# Altium schematic sheet Sensors.SchDoc
size Letter; SheetNumber: 11
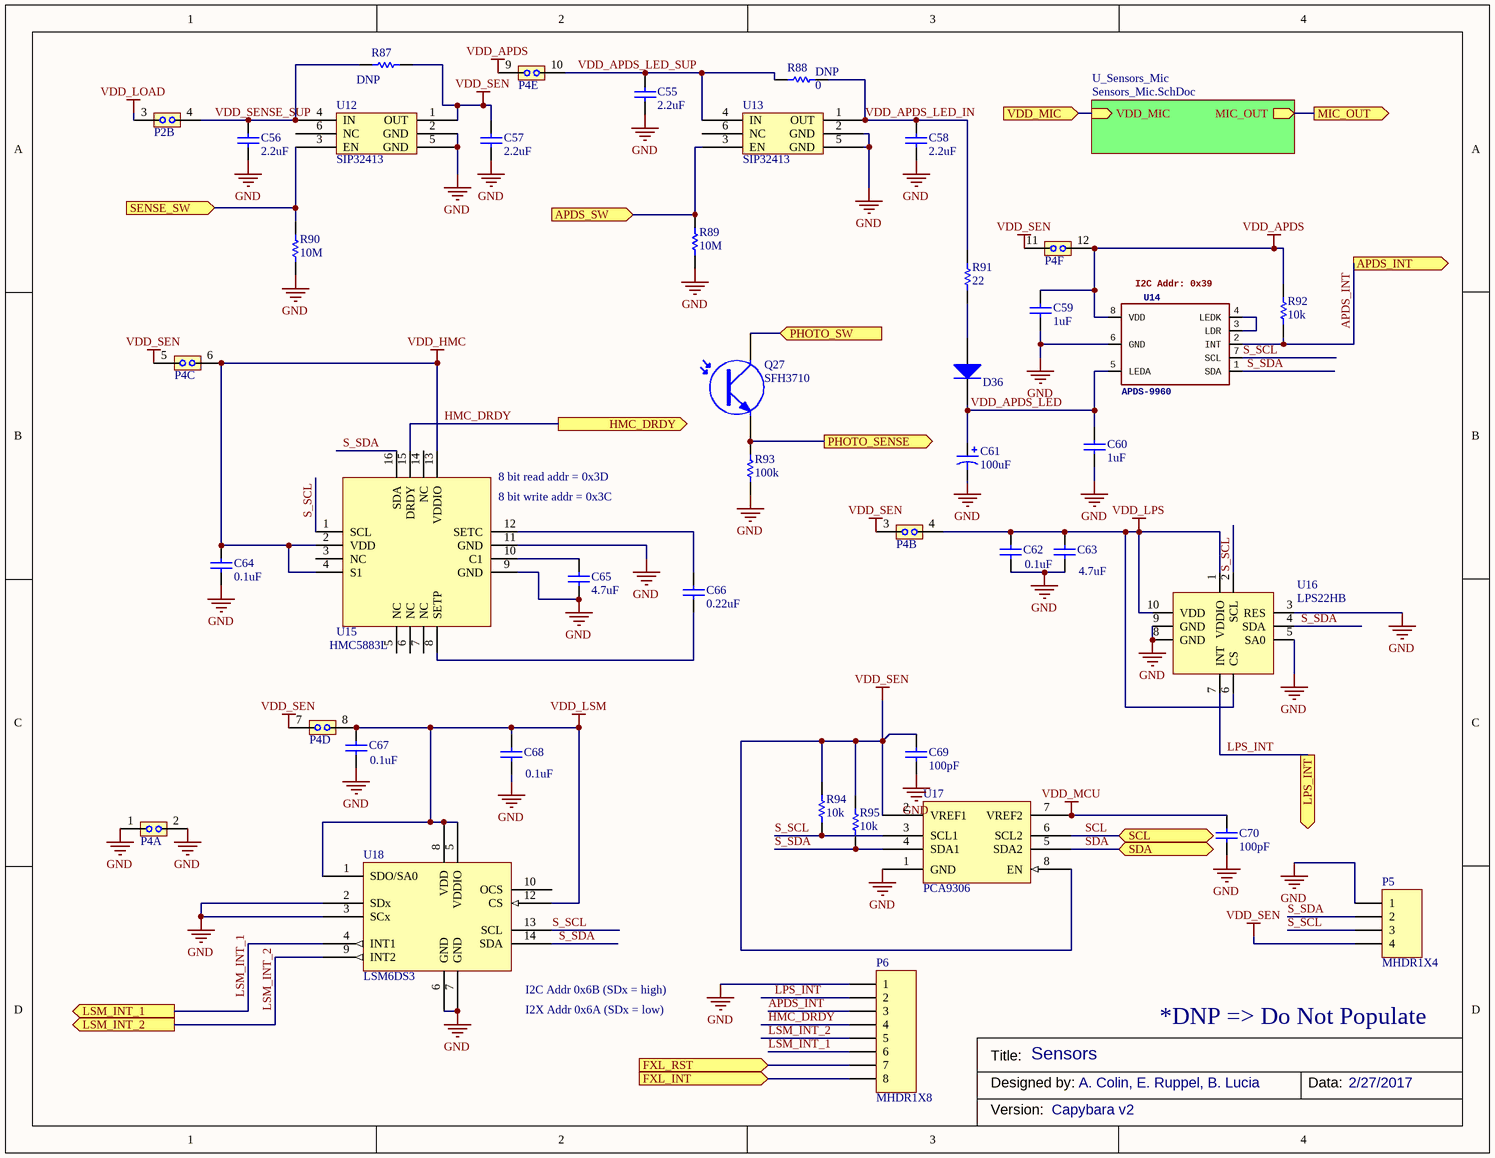
[diagram p0: Sensors.SchDoc]

## Parts
C55  value 2.2uF  [0603]  (hidden comment: Cap)
C56  value 2.2uF  [0603]  (hidden comment: Cap)
C57  value 2.2uF  [0603]  (hidden comment: Cap)
C58  value 2.2uF  [0603]  (hidden comment: Cap)
C59  value 1uF  [0603]  (hidden comment: Cap)
C60  value 1uF  [0603]  (hidden comment: Cap)
C61  value 100uF  [0805]  (hidden comment: Cap - Polarized)
C62  value 0.1uF  [0603]  (hidden comment: Cap)
C63  value 4.7uF  [0603]  (hidden comment: Cap)
C64  value 0.1uF  [0603]  (hidden comment: Cap)
C65  value 4.7uF  [0603]  (hidden comment: Cap)
C66  value 0.22uF  [0603]  (hidden comment: Cap)
C67  value 0.1uF  [0603]  (hidden comment: Cap)
C68  value 0.1uF  [0603]  (hidden comment: Cap)
C69  value 100pF  [0603]  (hidden comment: Cap)
C70  value 100pF  [0603]  (hidden comment: Cap)
D36  Diode  [SOD-523]  (value not drawn)
P2  JMPHDR_8  [MHDR2X8]  (value not drawn)  (part B of 8)
P4  JMPHDR_6  [MHDR2X6]  (value not drawn)  (parts A,B,C,D,E,F of 6)
P5  MHDR1X4  [MHDR1X4]
P6  MHDR1X8  [MHDR1X8]
Q27  SFH3710  [0805-W]
R87  Note: DNP  [0603]  (hidden comment: Res)
R88  value 0  Note: DNP  [0603]  (hidden comment: Res)
R89  value 10M  [0603]  (hidden comment: Res)
R90  value 10M  [0603]  (hidden comment: Res)
R91  value 22  [0603]  (hidden comment: Res)
R92  value 10k  [0603]  (hidden comment: Res)
R93  value 100k  [0603]  (hidden comment: Res)
R94  value 10k  [0603]  (hidden comment: Res)
R95  value 10k  [0603]  (hidden comment: Res)
U12  SIP32413  [SC70-6]
U13  SIP32413  [SC70-6]
U14  APDS-9960  [DFN_APDS_v2]
U15  HMC5883L  [SPARKFUN_16LPCC-DUP]
U16  LPS22HB  [HLGA-10L]
U17  PCA9306  [8-VFSOP]
U18  LSM6DS3  [LGA-14]

## Sub-sheets
U_Sensors_Mic = Sensors_Mic.SchDoc: MIC_OUT (out), VDD_MIC (in)

## Ports
APDS_INT (out), APDS_SW (in), FXL_INT (in), FXL_RST (in), HMC_DRDY (out), LPS_INT (out), LSM_INT_1 (out), LSM_INT_2 (out), MIC_OUT (out), PHOTO_SENSE (out), PHOTO_SW (in), SCL (bidir), SDA (bidir), SENSE_SW (in), VDD_MIC (in)

## Nets
GND: C55.1 C56.1 C57.1 C58.1 C59.1 C60.1 C61.2 C62.2 C63.2 C64.2 C65.2 C67.2 C68.2 C69.1 C70.1 P4.1 P4.2 P5.1 P6.1 R89.1 R90.1 R93.1 U12.2(GND) U12.5(GND) U13.2(GND) U13.5(GND) U14.6(GND) U15.9(GND) U15.11(GND) U16.3(RES) U16.5(SA0) U16.8(GND) U16.9(GND) U17.1(GND) U18.2(SDx) U18.3(SCx) U18.6(GND) U18.7(GND)
VDD_APDS: C59.2 P4.9 P4.12 R92.2 U14.8(VDD)
VDD_HMC: C64.1 P4.6 U15.2(VDD) U15.4(S1) U15.13(VDDIO)
VDD_LOAD: P2.3
VDD_LPS: C62.1 C63.1 P4.4 U16.1(VDDIO) U16.6(CS) U16.10(VDD)
VDD_LSM: C67.1 C68.1 P4.8 U18.1(SDO/SA0) U18.5(VDDIO) U18.8(VDD) U18.12(CS)
VDD_MCU: C70.2 U17.7(VREF2)
VDD_SEN: C57.2 C69.2 P4.3 P4.5 P4.7 P4.11 P5.4 R87.2 R94.2 R95.2 U12.1(OUT) U17.2(VREF1) U17.8(EN)
APDS_INT: P6.3 R92.1 U14.2(INT) ; port APDS_INT
APDS_SW: R89.2 U13.3(EN) ; port APDS_SW
FXL_INT: P6.8 ; port FXL_INT
FXL_RST: P6.7 ; port FXL_RST
HMC_DRDY: P6.4 U15.15(DRDY) ; port HMC_DRDY
LPS_INT: P6.2 U16.7(INT) ; port LPS_INT
LSM_INT_1: P6.6 U18.4(INT1) ; port LSM_INT_1
LSM_INT_2: P6.5 U18.9(INT2) ; port LSM_INT_2
MIC_OUT: port MIC_OUT, sheet U_Sensors_Mic/MIC_OUT
PHOTO_SENSE: Q27.2(E) R93.2 ; port PHOTO_SENSE
PHOTO_SW: Q27.1(C) ; port PHOTO_SW
S_SCL: P5.3 R94.1 U14.7(SCL) U15.1(SCL) U16.2(SCL) U17.3(SCL1) U18.13(SCL)
S_SDA: P5.2 R95.1 U14.1(SDA) U15.16(SDA) U16.4(SDA) U17.4(SDA1) U18.14(SDA)
SCL: U17.6(SCL2) ; port SCL
SDA: U17.5(SDA2) ; port SDA
SENSE_SW: R90.2 U12.3(EN) ; port SENSE_SW
VDD_APDS_LED: C60.2 C61.1 D36.2(C) U14.5(LEDA)
VDD_APDS_LED_IN: C58.2 R88.2 R91.2 U13.1(OUT)
VDD_APDS_LED_SUP: C55.2 P4.10 R88.1 U13.4(IN)
VDD_MIC: port VDD_MIC, sheet U_Sensors_Mic/VDD_MIC
VDD_SENSE_SUP: C56.2 P2.4 R87.1 U12.4(IN)
NetC65_1: C65.1 U15.10(C1)
NetC66_1: C66.1 U15.8(SETP)
NetC66_2: C66.2 U15.12(SETC)
NetD36_1: D36.1(A) R91.1
NetU14_3: U14.3(LDR) U14.4(LEDK)

Not connected (* = marked no-connect by the designer): U12 6(NC); U13 6(NC); U15 3(NC) 5(NC) 6(NC) 7(NC) 14(NC); U18 10(OCS)

## Notes on the sheet
- (near U14) I2C Addr: 0x39
- (near U15) 8 bit read addr = 0x3D
- (near U15) 8 bit write addr = 0x3C
- (near U18) I2C Addr 0x6B (SDx = high)
- (near U18) I2X Addr 0x6A (SDx = low)
- *DNP => Do Not Populate
- Title:
- Designed by:
- Sensors
- A. Colin, E. Ruppel, B. Lucia
- Data:
- 2/27/2017
- Version:
- Capybara v2

## Library data of the parts
C55-C58 = Cap: Ceramic Capacitor (Surface Mount); Manufacturer: Murata Electronics North America; Manufacturer Part Number: GRM188R61C225KE15D; Digi-Key Part Number: *; Note: *; Rating: *; Distributor Part Number: 490-3296-1-ND; Distributor: Digi-Key
C59 C60 = Cap: Ceramic Capacitor (Surface Mount); Manufacturer: Murata Electronics North America; Manufacturer Part Number: GRM188R61A105KA61D; Note: *; Rating: *; Distributor Part Number: 490-1543-1-ND; Distributor: Digi-Key
C61 = Cap - Polarized: Polarized Capacitor; Manufacturer Part Number: GRM21BR60G107ME15L; Manufacturer: Murata Electronics North America; Digi-Key Part Number: *; Rating: *; Note: *; Distributor: Mouser; Mouser Part Number: 81-GRM21BR60G107ME5L
C62 C64 C67 C68 = Cap: Ceramic Capacitor (Surface Mount); Manufacturer: Murata Electronics North America; Manufacturer Part Number: GRM188R71C104KA01D; Note: *; Rating: *; Distributor Part Number: 490-1532-1-ND; Distributor: Digi-Key
C63 = Cap: Ceramic Capacitor (Surface Mount); Manufacturer: Samsung Electro-Mechanics; Manufacturer Part Number: CL10B475KQ8NQNC; Note: *; Rating: *; Distributor Part Number: 1276-2087-1-ND; Distributor: Digi-Key
C65 = Cap: CAP CER 4.7UF 4V X6S; Manufacturer: Samsung Electro-Mechanics; Manufacturer Part Number: CL10B475KQ8NQNC; Note: *; Rating: *; Distributor Part Number: 1276-2087-1-ND; Distributor: Digi-Key
C66 = Cap: Ceramic Capacitor (Surface Mount); Manufacturer: Murata Electronics North America; Manufacturer Part Number: GRM188R71E224KA88D; Note: *; Rating: *; Distributor Part Number: 490-3290-1-ND; Distributor: Digi-Key
C69 C70 = Cap: Ceramic Capacitor (Surface Mount); Manufacturer: Kemet; Manufacturer Part Number: C0603C101J5GACTU; Digi-Key Part Number: *; Note: *; Rating: *; Distributor Part Number: 399-1061-1-ND; Distributor: Digi-Key
D36 = Diode: General Purpose Diode; Manufacturer: Vishay Semiconductor; Manufacturer Part Number: BAS40-02V-V-G-08; Digi-Key Part Number: BAS40-02V-V-G-08GICT-ND; Value: *; Rating: *; Note: *; Distributor Part Number: 78-BAS40-02V-V-G-08; Distributor: Mouser; Mouser Part Number: 78-BAS40-02V-V-G-08
P4 = JMPHDR_6: Manufacturer: Sullins Connector Solutions; Manufacturer Part Number: GRPB062VWVN-RC; Digi-Key Part Number: S9015E-06-ND; Distributor: Digikey; Distributor Part Number: S9015E-06-ND
P5 = MHDR1X4: Header, 4-Pin; Manufacturer: Harwin Inc.; Manufacturer Part Number: M52-5000445; LatestRevisionDate: 17-Jul-2002; LatestRevisionNote: Re-released for DXP Platform.; Publisher: Altium Limited; Digi-Key Part Number: 952-3358-ND; Distributor: Mouser; Distributor Part Number: 855-M52-5000445; Mouser Part Number: 855-M52-5000445
P6 = MHDR1X8: Header, 8-Pin; Manufacturer: Harwin Inc.; Manufacturer Part Number: M52-5000845; LatestRevisionDate: 17-Jul-2002; LatestRevisionNote: Re-released for DXP Platform.; Publisher: Altium Limited; Digi-Key Part Number: 952-3361-ND; Distributor: Mouser; Distributor Part Number: 855-M52-5000845; Mouser Part Number: 855-M52-5000845
Q27 = Photo NPN: NPN Phototransistor; Manufacturer: OSRAM Opto Semiconductors Inc; Manufacturer Part Number: SFH 3710-3/4-Z; Digi-Key Part Number: 475-1268-1-ND; Value: *; Rating: *; Note: *; Distributor: Mouser; Distributor Part Number: 720-SFH3710-3/4-Z; Mouser Part Number: 720-SFH3710-3/4-Z
R87 = Res: Chip Resistor (Surface Mount); Manufacturer: Yageo; Manufacturer Part Number: RC0603JR-070RL; Value: 0; Digi-Key Part Number: *; Rating: *; Distributor: Digi-Key; Distributor Part Number: 311-0.0GRCT-ND
R88 = Res: Chip Resistor (Surface Mount); Manufacturer: Yageo; Manufacturer Part Number: RC0603JR-070RL; Digi-Key Part Number: *; Rating: *; Distributor: Digi-Key; Distributor Part Number: 311-0.0GRCT-ND
R89 R90 = Res: Chip Resistor (Surface Mount); Manufacturer: Yageo; Manufacturer Part Number: RC0603JR-0710ML; Digi-Key Part Number: *; Rating: *; Note: *; Distributor: Digi-Key; Distributor Part Number: 311-10MGRCT-ND
R91 = Res: Chip Resistor (Surface Mount); Manufacturer: Vishay Beyschlag; Manufacturer Part Number: MCT06030C2209FP500; Digi-Key Part Number: *; Rating: *; Note: *; Distributor: Digi-Key; Distributor Part Number: MCT0603-22.0-CFCT-ND
R92 R94 R95 = Res: Chip Resistor (Surface Mount); Manufacturer: Yageo; Manufacturer Part Number: RC0603FR-0710KL; Digi-Key Part Number: *; Rating: *; Note: *; Distributor: Digi-Key; Distributor Part Number: 311-10.0KHRCT-ND
R93 = Res: Chip Resistor (Surface Mount); Manufacturer: Yageo; Manufacturer Part Number: RT0603FRE07100KL; Digi-Key Part Number: *; Rating: *; Note: *; Distributor: Digi-Key; Distributor Part Number: YAG2319CT-ND
U12 U13 = SIP32431: Manufacturer: Vishay Semiconductors; Manufacturer Part Number: SIP32431DR3-T1GE3; Digi-Key Part Number: SIP32431DR3-T1GE3CT-ND; Distributor: Mouser; Distributor Part Number: 781-SIP32431DR3-GE3; Mouser Part Number: 781-SIP32431DR3-GE3
U14 = APDS-9960: Avago APDS-9960 digital proximity, ambient light, RGB, and gesture sensor.; Manufacturer: Broadcom Limited; PROD_ID: SEN-12005; Digi-Key Part Number: 516-3480-1-ND; Distributor: Mouser; Distributor Part Number: 630-APDS-9960; Manufacturer Part Number: APDS-9960; Mouser Part Number: 630-APDS-9960
U15 = HMC5883L: IC COMPASS 3 AXIS I2C 16LCC SMD; Manufacturer: Honeywell; Manufacturer Part Number: HMC5883L-TR; Rating: *; Value: *; Note: *; Distributor: eBay; Digi-Key Part Number: 342-1082-1-ND
U16 = LPS22HB: Manufacturer: STMicroelectronics; Manufacturer Part Number: LPS22HBTR; Digi-Key Part Number: 497-16265-1-ND; Distributor: Mouser; Distributor Part Number: 511-LPS22HBTR; Mouser Part Number: 511-LPS22HBTR
U17 = PCA9306: I2C Level Shifter; Manufacturer Part Number: PCA9306DCURG4; Manufacturer: Texas Instruments; Digi-Key Part Number: 296-46174-1-ND; Distributor: Mouser; Distributor Part Number: 595-PCA9306DCURG4; Mouser Part Number: 595-PCA9306DCURG4
U18 = LSM6DS3: Manufacturer: ST Microelectronics; Manufacturer Part Number: LSM6DS3TR; PurchaseNote: or Farnell 2474253; Name: LSM6DS3; Distributor: Mouser; Distributor Part Number: 511-LSM6DS3TR; Digi-Key Part Number: 497-15383-1-ND; Mouser Part Number: 511-LSM6DS3TR